# Altium schematic sheet AS5047.SchDoc
size A4; Organization: Altium Limited; Address1: L3, 12a Rodborough Rd; Address2: Frenchs Forest; Address3: NSW; Address4: Australia 2086
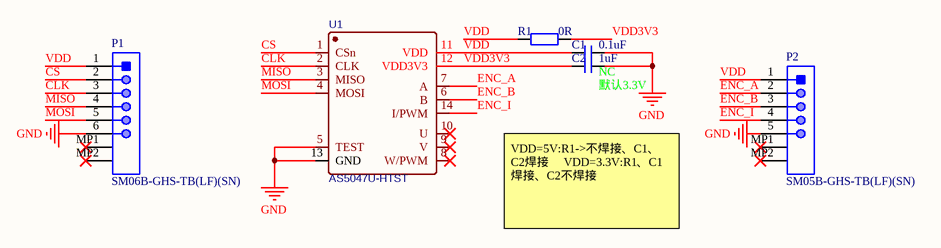
[diagram p0: AS5047.SchDoc]

## Parts
C1  0.1uF  [C 0603_L]
C2  1uF  [C 0603_L]
P1  SM06B-GHS-TB(LF)(SN)  [JST-SM06B-GHS-TB_V]
P2  SM05B-GHS-TB(LF)(SN)  [JST-SM05B-GHS-TB_V]
R1  0R  [R 0603_L]
U1  AS5047U-HTST  [TSSOP-14_L5.0-W4.4-P0.65-LS6.4-BL]

## Nets
GND: C1.2 C2.2 P1.6 P2.5 U1.5(TEST) U1.13(GND)
CLK: P1.3 U1.2(CLK)
CS: P1.2 U1.1(CSn)
ENC_A: P2.2 U1.7(A)
ENC_B: P2.3 U1.6(B)
ENC_I: P2.4 U1.14(I/PWM)
MISO: P1.4 U1.3(MISO)
MOSI: P1.5 U1.4(MOSI)
VDD: C1.1 P1.1 P2.1 R1.1 U1.11(VDD)
VDD3V3: C2.1 R1.2 U1.12(VDD3V3)

Not connected (* = marked no-connect by the designer): P1 MP1* MP2*; P2 MP1* MP2*; U1 8(W/PWM)* 9(V)* 10(U)*

## Notes on the sheet
- (near C2) NC
- (near C2) 默认3.3V
- VDD=5V:R1->不焊接、C1、C2焊接     VDD=3.3V:R1、C1焊接、C2不焊接
- Title
- Size:
- Date:
- A4
- Number:
- Time:
- Revision:
- Sheet
- of
- File:

## Library data of the parts
C1 C2 = C: 贴片电容
P1 = SM06B-GHS-TB(LF)(SN): GH Disconnectable Crimp Style Connector, Pitch 1.25 mm, 1 x 6 Position, Height 4.25 mm, -25 to 85 degC, RoHS, Tape and Reel; Manufacturer: JST; No of Positions: 6; Pitch: 1.25mm; Style/Orientation: RightAngleHeader/Plug; Package Reference: SM06B-GHS-TB; Type: WiretoBoard; Datasheet URL: http://www.jst-mfg.com/product/pdf/eng/eGH.pdf; Termination: Crimp; Manufacturer URL: http://www.jst.com/home2.html; Mounting Technology: SurfaceMount; Datasheet Version: 05/2016; Package Description: GH Disconnectable Crimp Style Connector, Pitch 1.25 mm, 1 x 6 Position, Height 4.25 mm
P2 = SM05B-GHS-TB(LF)(SN): GH Disconnectable Crimp Style Connector, Pitch 1.25 mm, 1 x 5 Position, Height 4.25 mm, -25 to 85 degC, RoHS, Tape and Reel; Manufacturer: JST; No of Positions: 5; Pitch: 1.25mm; Style/Orientation: RightAngleHeader/Plug; Package Reference: SM05B-GHS-TB; Type: WiretoBoard; Datasheet URL: http://www.jst-mfg.com/product/pdf/eng/eGH.pdf; Termination: Crimp; Manufacturer URL: http://www.jst.com/home2.html; Mounting Technology: SurfaceMount; Datasheet Version: 05/2016; Package Description: GH Disconnectable Crimp Style Connector, Pitch 1.25 mm, 1 x 5 Position, Height 4.25 mm
R1 = R: 贴片电阻
U1 = AS5047U-HTST: BOM_Manufacturer: 美国AMS; Contributor: LCSC; BOM_Supplier: LCSC; BOM_Supplier Part: C2153660; BOM_Manufacturer Part: AS5047U-HTST; spicePre: U; spiceSymbolName: AS5047U-HTST